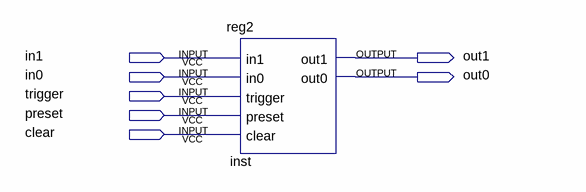
[diagram p0: schematic sheet]
// Quartus schematic reg2_symbol.bdf as structural Verilog: 1 symbols, 7 pins
module reg2_symbol (
  input  in1,
  input  in0,
  input  trigger,
  input  preset,
  input  clear,
  output out1,
  output out0
);

  reg2 inst (.in1(in1), .in0(in0), .trigger(trigger), .preset(preset), .clear(clear), .out1(out1), .out0(out0));
endmodule
